# Altium project SENSORES.PrjPcb
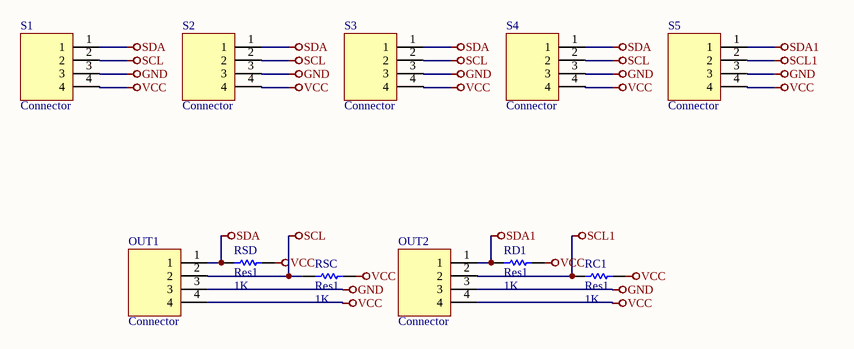
[diagram p0: Sch_Sensores.SchDoc]
1 sheet, 11 parts. Net scope: global (net labels, ports and power ports of the same name join across sheets).
Board files: Pcb_Sensores.PcbDoc, TODO.PcbDoc

## Sheet Sch_Sensores.SchDoc
size A4

### Parts
OUT1  Connector  [1x4x2.54 Pin Header TH V]
OUT2  Connector  [1x4x2.54 Pin Header TH V]
RC1  Res1  value 1K  [AXIAL-0.3]
RD1  Res1  value 1K  [AXIAL-0.3]
RSC  Res1  value 1K  [AXIAL-0.3]
RSD  Res1  value 1K  [AXIAL-0.3]
S1  Connector  [1x4x2.54 Pin Header TH V]
S2  Connector  [1x4x2.54 Pin Header TH V]
S3  Connector  [1x4x2.54 Pin Header TH V]
S4  Connector  [1x4x2.54 Pin Header TH V]
S5  Connector  [1x4x2.54 Pin Header TH V]

### Nets
GND: OUT1.3 OUT2.3 S1.3 S2.3 S3.3 S4.3 S5.3
SCL: OUT1.2 RSC.1 S1.2 S2.2 S3.2 S4.2
SCL1: OUT2.2 RC1.1 S5.2
SDA: OUT1.1 RSD.1 S1.1 S2.1 S3.1 S4.1
SDA1: OUT2.1 RD1.1 S5.1
VCC: OUT1.4 OUT2.4 RC1.2 RD1.2 RSC.2 RSD.2 S1.4 S2.4 S3.4 S4.4 S5.4

### Library data of the parts
OUT1 OUT2 S1-S5 = Header 1x4
RC1 RD1 RSC RSD = Res1: Resistor; Published: 8-Jun-2000; LatestRevisionDate: 17-Jul-2002; LatestRevisionNote: Re-released for DXP Platform.; PackageReference: AXIAL-0.3; Publisher: Altium Limited; PackageDescription: Axial Device, Thru-Hole; 2 Leads; 0.3 in Pin Spacing